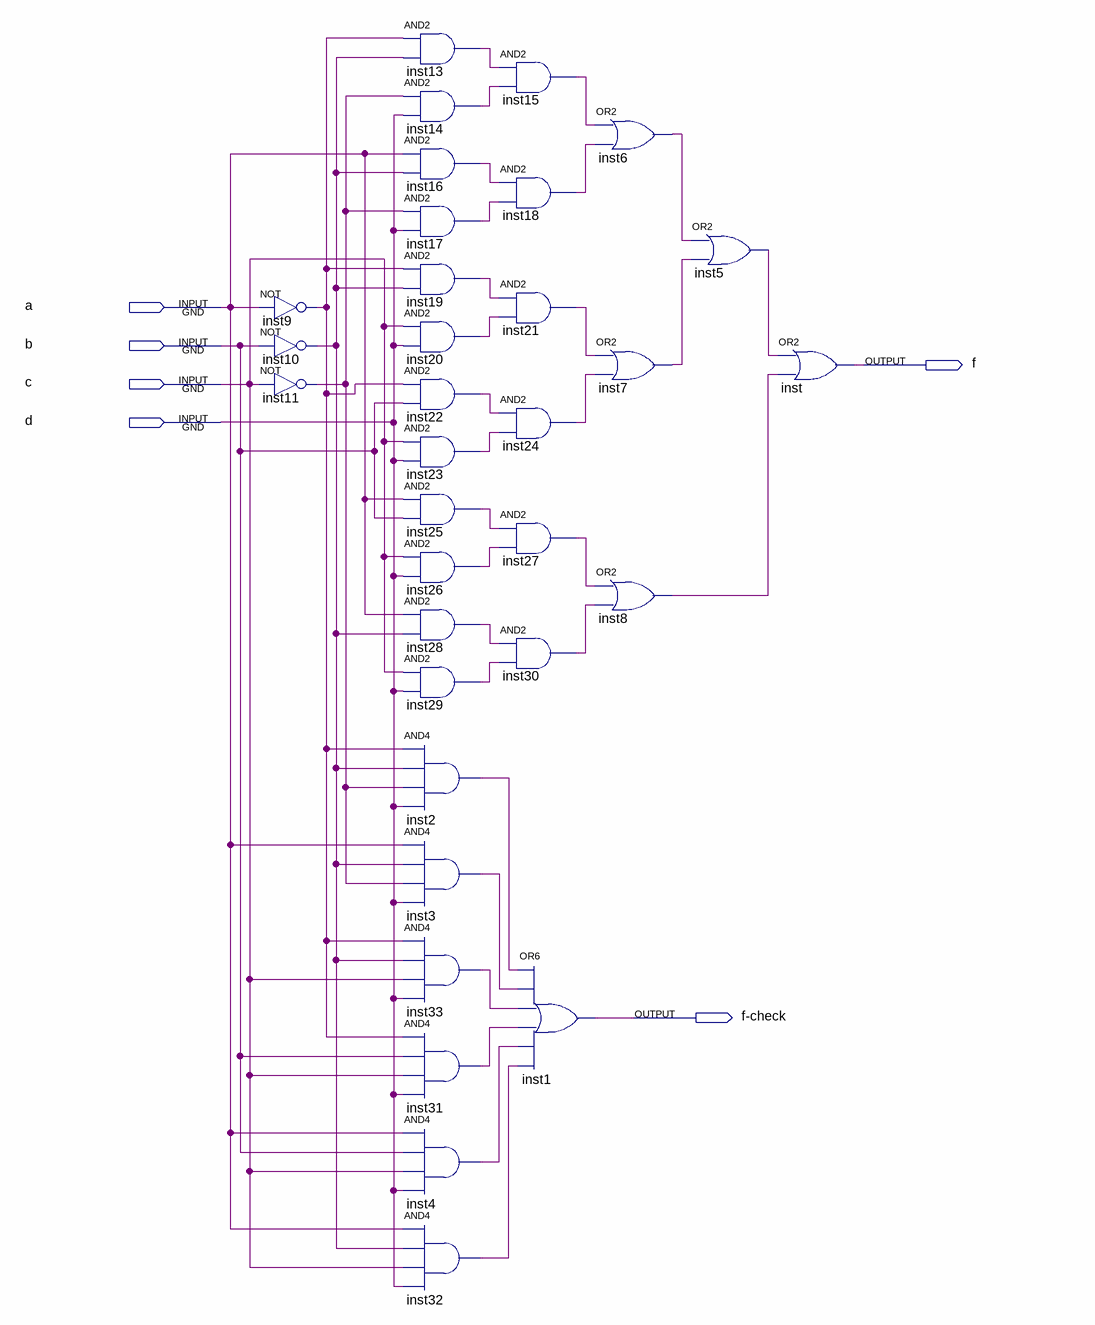
[diagram p0: schematic sheet]
// Quartus schematic 1-5-before.bdf as structural Verilog: 33 symbols, 6 pins
module \1-5-before  (
  input  a,
  input  b,
  input  c,
  input  d,
  output f,
  output \f-check 
);

  wire inst2_out, inst3_out, inst4_out, inst5_out, inst6_out, inst7_out, inst8_out, inst9_out, inst10_out,
       inst11_out, inst13_out, inst14_out, inst15_out, inst16_out, inst17_out, inst18_out, inst19_out,
       inst20_out, inst21_out, inst22_out, inst23_out, inst24_out, inst25_out, inst26_out, inst27_out,
       inst28_out, inst29_out, inst30_out, inst31_out, inst32_out, inst33_out;

  not inst9 (inst9_out, a);
  not inst10 (inst10_out, b);
  not inst11 (inst11_out, c);
  and inst13 (inst13_out, inst9_out, inst10_out);
  and inst14 (inst14_out, inst11_out, d);
  and inst16 (inst16_out, a, inst10_out);
  and inst17 (inst17_out, inst11_out, d);
  and inst19 (inst19_out, inst9_out, inst10_out);
  and inst20 (inst20_out, c, d);
  and inst22 (inst22_out, inst9_out, b);
  and inst23 (inst23_out, c, d);
  and inst25 (inst25_out, a, b);
  and inst26 (inst26_out, c, d);
  and inst28 (inst28_out, a, inst10_out);
  and inst29 (inst29_out, c, d);
  and inst2 (inst2_out, inst9_out, inst10_out, inst11_out, d);
  and inst3 (inst3_out, a, inst10_out, inst11_out, d);
  and inst33 (inst33_out, inst9_out, inst10_out, c, d);
  and inst31 (inst31_out, inst9_out, b, c, d);
  and inst4 (inst4_out, a, b, c, d);
  and inst32 (inst32_out, a, inst10_out, c, d);
  and inst15 (inst15_out, inst13_out, inst14_out);
  and inst18 (inst18_out, inst16_out, inst17_out);
  and inst21 (inst21_out, inst19_out, inst20_out);
  and inst24 (inst24_out, inst22_out, inst23_out);
  and inst27 (inst27_out, inst25_out, inst26_out);
  and inst30 (inst30_out, inst28_out, inst29_out);
  or inst1 (\f-check , inst2_out, inst3_out, inst33_out, inst31_out, inst4_out, inst32_out);
  or inst6 (inst6_out, inst15_out, inst18_out);
  or inst7 (inst7_out, inst21_out, inst24_out);
  or inst8 (inst8_out, inst27_out, inst30_out);
  or inst5 (inst5_out, inst6_out, inst7_out);
  or inst (f, inst5_out, inst8_out);
endmodule
